# Altium project Telem.PrjPCB
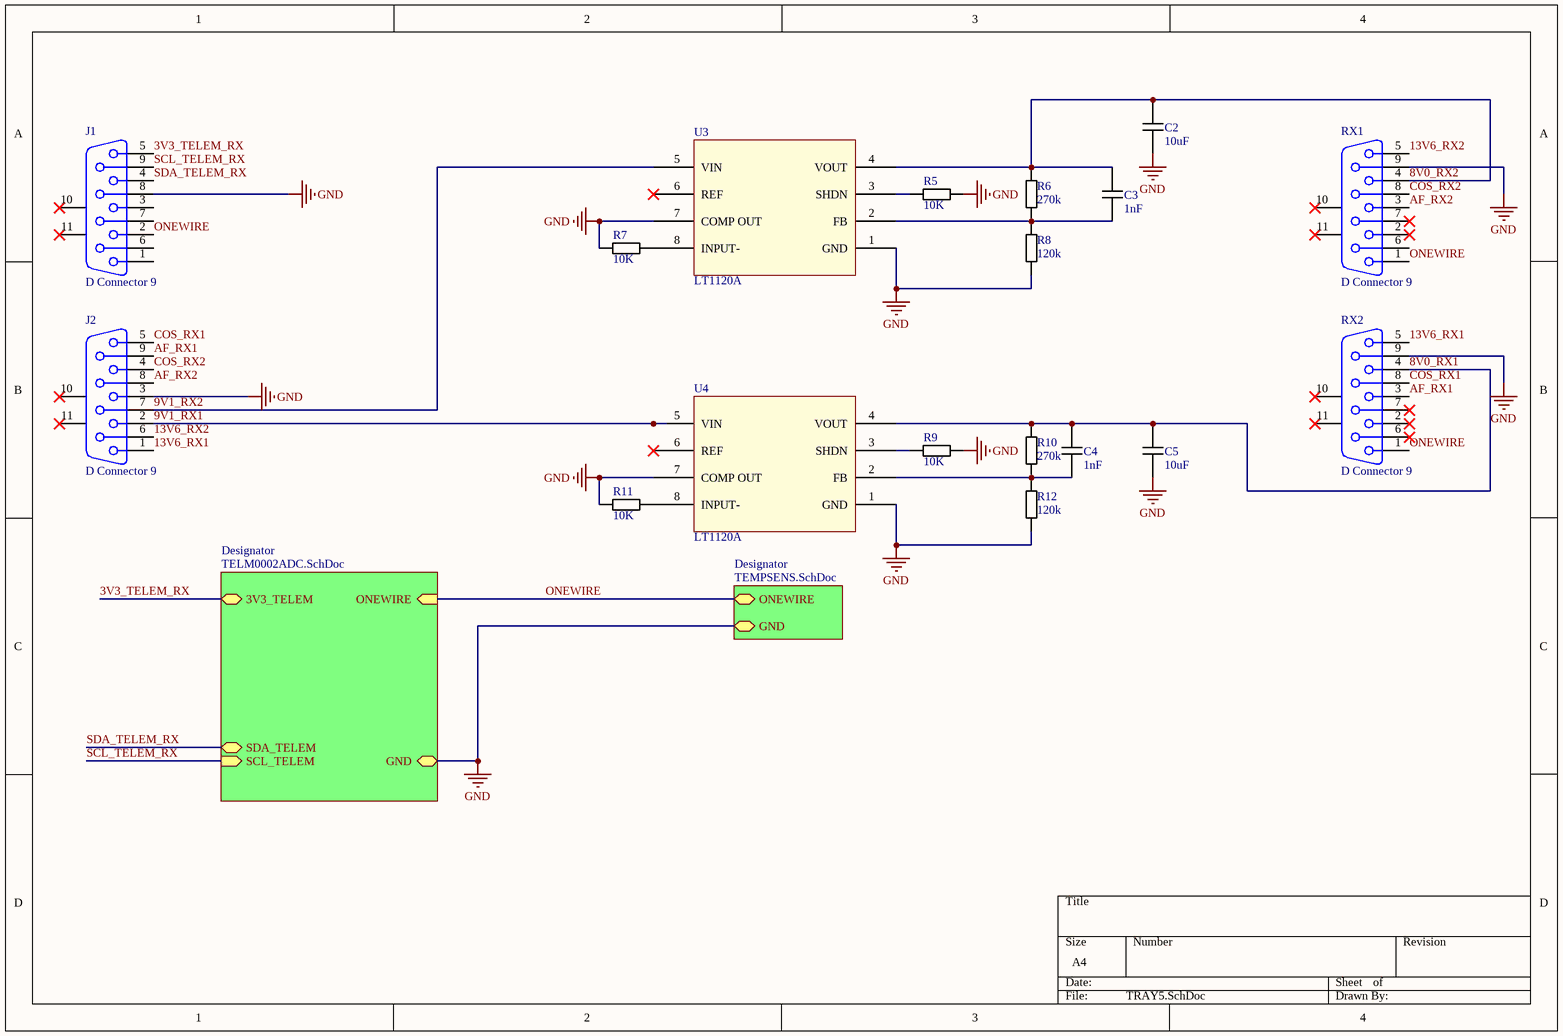
[diagram p0: TRAY5.SchDoc]
3 sheets, 29 parts. Net scope: strictly hierarchical (ports join the sheet entries above them; power ports are local).
Board file: TRAY5.PcbDoc
Sheets:
  TRAY5.SchDoc
    Designator = TELM0002ADC.SchDoc
    Designator = TEMPSENS.SchDoc

## Sheet TRAY5.SchDoc
size A4

### Parts
C2  value 10uF  [0805 Cap]  (hidden comment: 0805 Cap)
C3  value 1nF  [0805 Cap]  (hidden comment: 0805 Cap)
C4  value 1nF  [0805 Cap]  (hidden comment: 0805 Cap)
C5  value 10uF  [0805 Cap]  (hidden comment: 0805 Cap)
J1  D Connector 9  [DSUB1.385-2H9]
J2  D Connector 9  [DSUB1.385-2H9]
R5  value 10K  [0805 Resistor]  (hidden comment: 0805 Resistor)
R6  value 270k  [0805 Resistor]  (hidden comment: 0805 Resistor)
R7  value 10K  [0805 Resistor]  (hidden comment: 0805 Resistor)
R8  value 120k  [0805 Resistor]  (hidden comment: 0805 Resistor)
R9  value 10K  [0805 Resistor]  (hidden comment: 0805 Resistor)
R10  value 270k  [0805 Resistor]  (hidden comment: 0805 Resistor)
R11  value 10K  [0805 Resistor]  (hidden comment: 0805 Resistor)
R12  value 120k  [0805 Resistor]  (hidden comment: 0805 Resistor)
RX1  D Connector 9  [DSUB Upright]
RX2  D Connector 9  [DSUB Upright]
U3  LT1120A  [SOIC8 - LT1120A]
U4  LT1120A  [SOIC8 - LT1120A]

### Sub-sheets
Designator = TELM0002ADC.SchDoc: SDA_TELEM (bidir), SCL_TELEM (in), ONEWIRE (in), 3V3_TELEM, GND
Designator = TEMPSENS.SchDoc: GND, ONEWIRE (bidir)

### Nets
3V3_TELEM_RX: J1.5 ; sheet Designator/3V3_TELEM
GND: C2.1 C5.1 J1.8 J2.3 R5.2 R7.1 R8.1 R9.2 R11.1 R12.1 RX1.9 RX2.9 U3.1(GND) U3.7(COMP_OUT) U4.1(GND) U4.7(COMP_OUT) ; sheet Designator/GND, sheet Designator/GND
8V0_RX1: C4.2 C5.2 R10.2 RX2.4 U4.4(VOUT)
8V0_RX2: C2.2 C3.2 R6.2 RX1.4 U3.4(VOUT)
9V1_RX1: J2.2 U4.5(VIN)
9V1_RX2: J2.7 U3.5(VIN)
13V6_RX1: J2.1 RX2.5
13V6_RX2: J2.6 RX1.5
AF_RX1: J2.9 RX2.3
AF_RX2: J2.8 RX1.3
COS_RX1: J2.5 RX2.8
COS_RX2: J2.4 RX1.8
ONEWIRE: J1.2 RX1.1 RX2.1 ; sheet Designator/ONEWIRE, sheet Designator/ONEWIRE
SCL_TELEM_RX: J1.9 ; sheet Designator/SCL_TELEM
SDA_TELEM_RX: J1.4 ; sheet Designator/SDA_TELEM
NetC3_1: C3.1 R6.1 R8.2 U3.2(FB)
NetC4_1: C4.1 R10.1 R12.2 U4.2(FB)
NetR5_1: R5.1 U3.3(SHDN)
NetR7_2: R7.2 U3.8(INPUT-)
NetR9_1: R9.1 U4.3(SHDN)
NetR11_2: R11.2 U4.8(INPUT-)

Not connected (* = marked no-connect by the designer): J1 1 3 6 7 10(MH1)* 11(MH2)*; J2 10(MH1)* 11(MH2)*; RX1 2* 6 7* 10(MH1)* 11(MH2)*; RX2 2* 6* 7* 10(MH1)* 11(MH2)*; U3 6(REF)*; U4 6(REF)*

### Library data of the parts
C2-C5 = 0805 MLCC - NP0, 5%: Supplier: Digikey
  C2 C5: Supplier P/N: JMK212AB7106KG-T
  C3 C4: Supplier P/N: UMK212B7105KG-T
J1 J2 RX1 RX2 = D Connector 9: Receptacle Assembly, 9 Position, Right Angle; Supplier: Digikey
R5-R12 = 0805 Thick Film Resistor 1%: Supplier: Digikey
  R6 R10: Supplier P/N: RC0805FR-07270KL
  R8 R12: Supplier P/N: RC0805FR-07120KL
U3 U4 = LT1120A: Supplier: Digikey; Supplier P/N: LT1120ACS8#PBF-ND

## Sheet TELM0002ADC.SchDoc: MAX127 Telemetry Circuit
size A3; Engineer: A. SHAW; Organization: BLUEsat Project; Address1: Room 419; Address2: School of EE&T; Address3: UNSW, NSW 2052; Address4: Australia; DocumentNumber: TELM0002; SheetNumber: 1; SheetTotal: 1; Description: Telemetry ADC Circuit; Version: 1.0
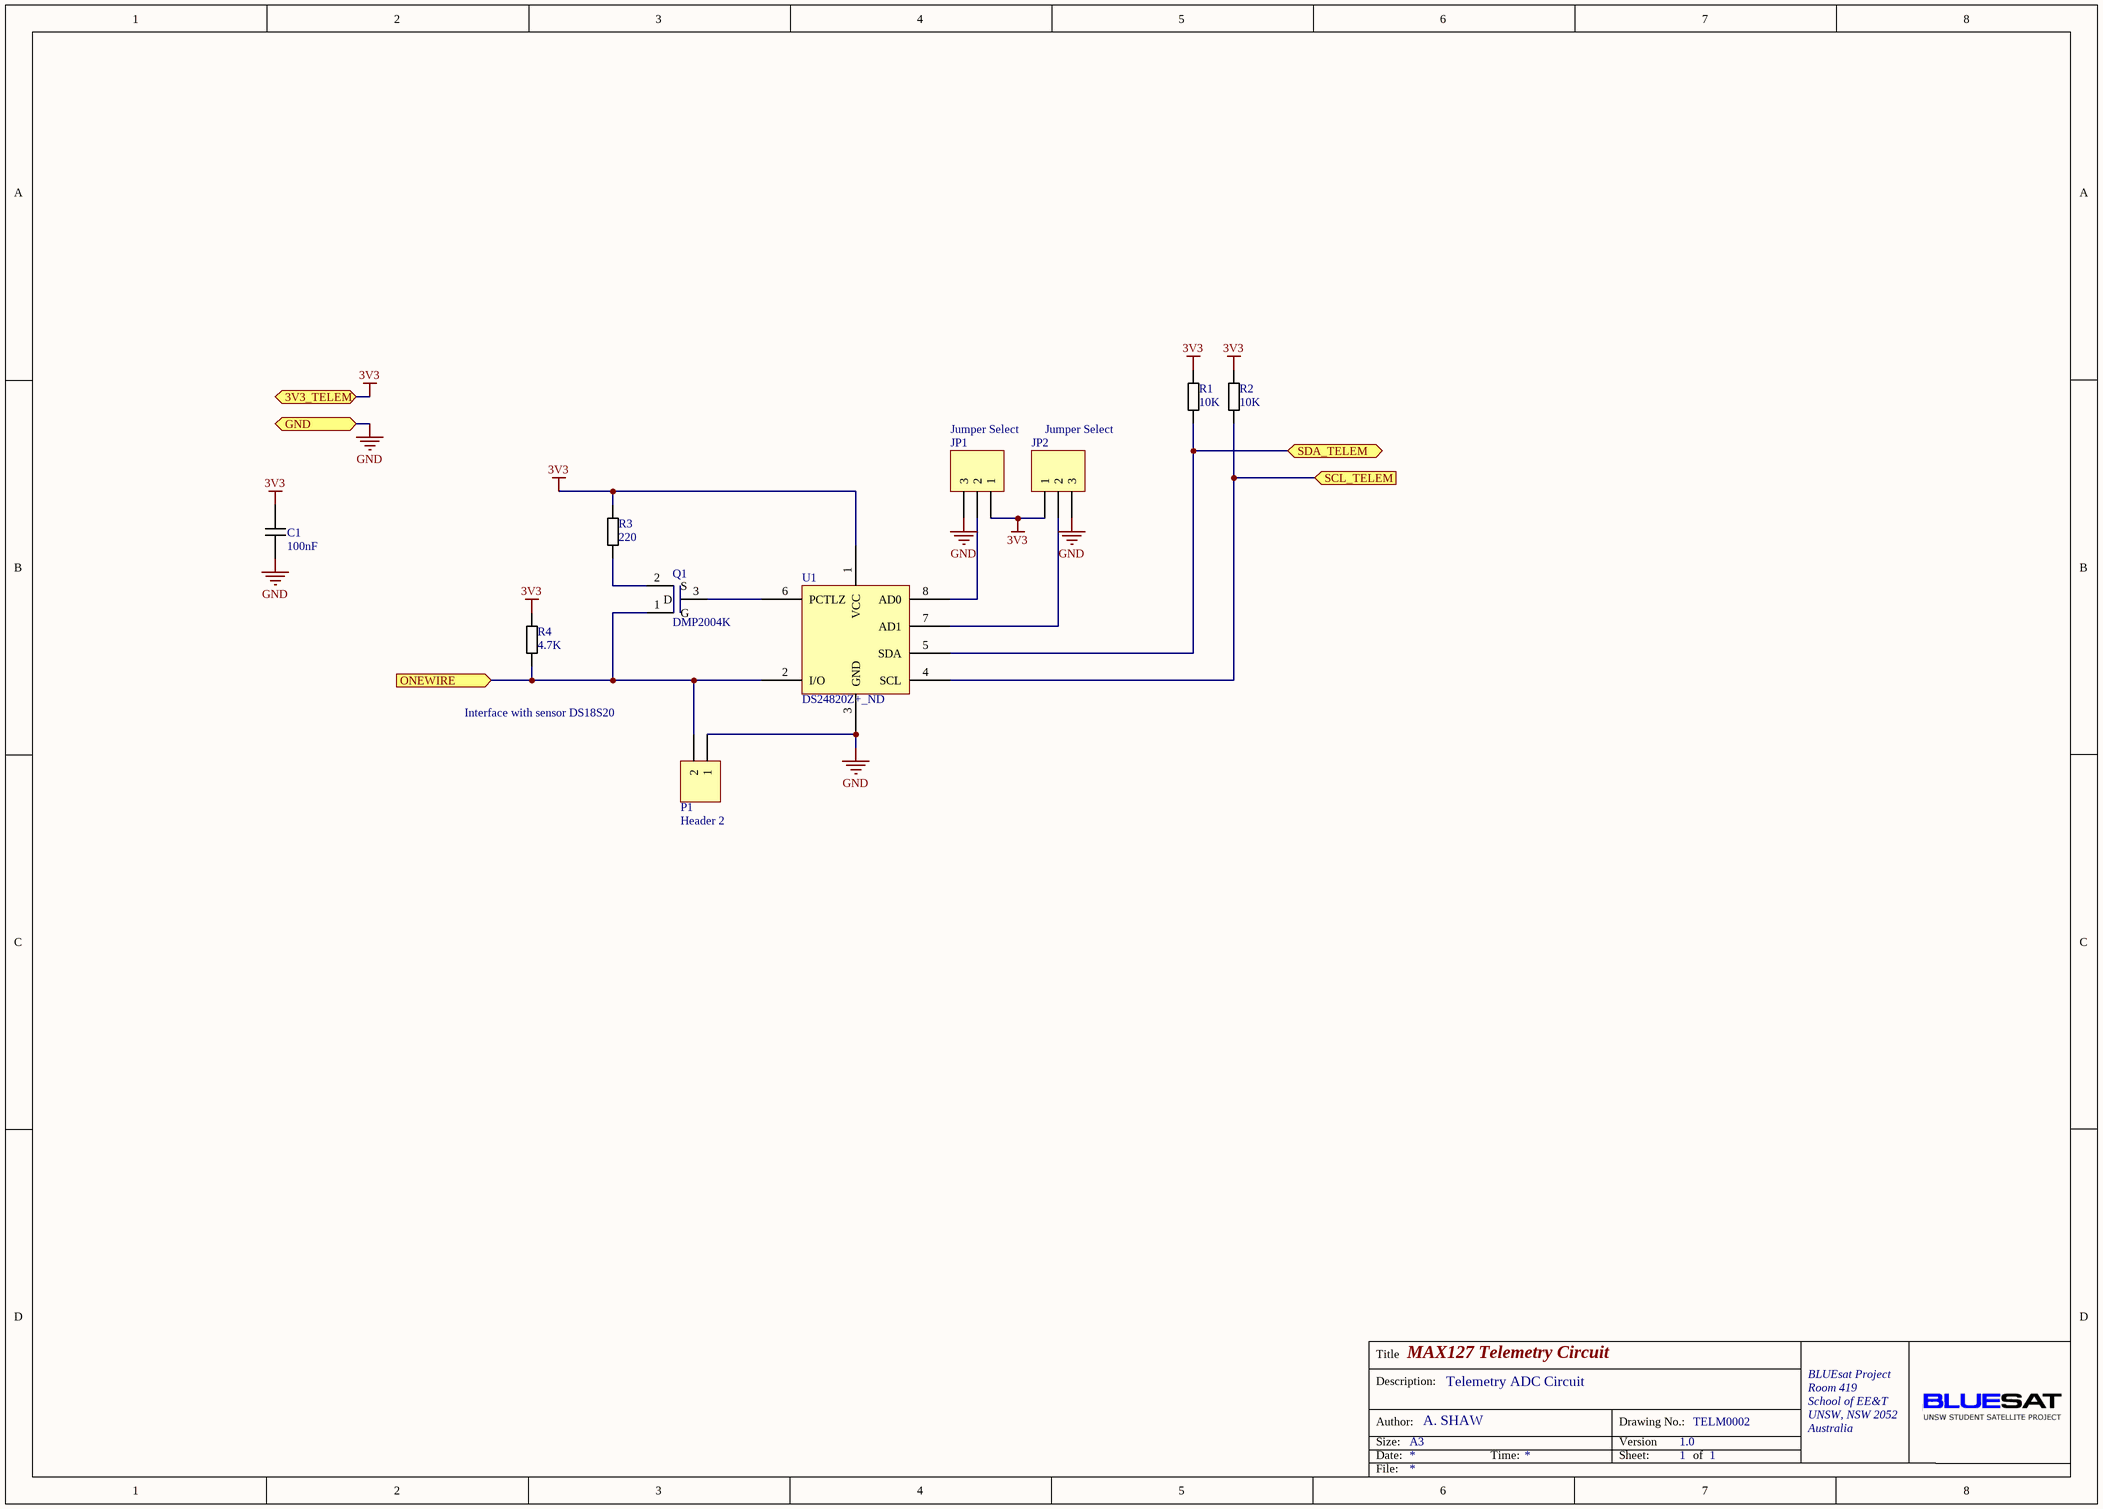
[diagram p1: TELM0002ADC.SchDoc]

### Parts
C1  value 100nF  [0805 Cap]  (hidden comment: 0805 Cap)
JP1  Jumper Select  [SOLDER_JUMPER_3_A]  (no BOM)
JP2  Jumper Select  [SOLDER_JUMPER_3_A]  (no BOM)
P1  Header 2  [HDR1X2]
Q1  DMP2004K  [DMP2004KDITR-ND]
R1  value 10K  [0805 Resistor]  (hidden comment: 0805 Resistor)
R2  value 10K  [0805 Resistor]  (hidden comment: 0805 Resistor)
R3  value 220  [0805 Resistor]  (hidden comment: 0805 Resistor)
R4  value 4.7K  [0805 Resistor]  (hidden comment: 0603 Resistor)
U1  DS24820Z+_ND  [DS2482-100]

### Ports
3V3_TELEM, GND, ONEWIRE (in), SCL_TELEM (in), SDA_TELEM (bidir)

### Nets
3V3: C1.2 JP1.1 JP2.1 R1.2 R2.2 R3.2 R4.2 U1.1(VCC) ; port 3V3_TELEM  [project net 3V3_TELEM_RX]
GND: C1.1 JP1.3 JP2.3 P1.1 U1.3(GND) ; port GND
ONEWIRE: P1.2 Q1.1(G) R4.1 U1.2(I/O) ; port ONEWIRE
SCL_TELEM_RX: R2.1 U1.4(SCL) ; port SCL_TELEM
SDA_TELEM_RX: R1.1 U1.5(SDA) ; port SDA_TELEM
NetJP1_2: JP1.2 U1.8(AD0)
NetJP2_2: JP2.2 U1.7(AD1)
NetQ1_2: Q1.2(S) R3.1
NetQ1_3: Q1.3(D) U1.6(PCTLZ)

### Notes on the sheet
- Interface with sensor DS18S20
- Title
- Description:
- Size:
- Author:
- Date:
- A3
- Time:
- Version
- Sheet:
- Drawing No.:
- of
- File:

### Library data of the parts
C1 = 0805 MLCC - X7R, 10%: Supplier: Digikey
JP1 JP2 = Header 3: Header, 3-Pin; Supplier: Digikey
P1 = Header 2: Header, 2-Pin; Supplier: Digikey
Q1 = DMP2004K: MOSFET P-CH 20V 600MA SOT23-3; Supplier: Digikey
R1-R3 = 0805 Thick Film Resistor 1%: Supplier: Digikey
R4 = 0603 Thick Film Resistor 1%: Supplier: Digikey
U1 = DS24820Z+_ND: Supplier: Digikey

## Sheet TEMPSENS.SchDoc
size A4
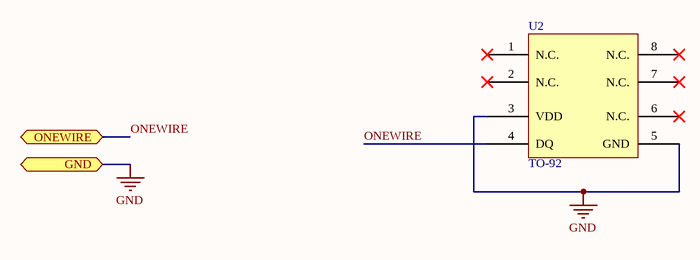
[diagram p2: TEMPSENS.SchDoc]

### Parts
U2  TO-92  [DS18S20]

### Ports
GND, ONEWIRE (bidir)

### Nets
GND: U2.3(VDD) U2.5(GND) ; port GND
ONEWIRE: U2.4(DQ) ; port ONEWIRE

Not connected (* = marked no-connect by the designer): U2 1(N.C.)* 2(N.C.)* 6(N.C.)* 7(N.C.)* 8(N.C.)*

### Library data of the parts
U2 = DS18S20

## Nets that join several sheets
3V3_TELEM_RX: TRAY5 (J1.5), TELM0002ADC (8 pins)
GND: TRAY5 (16 pins), TELM0002ADC (5 pins), TEMPSENS (U2.3 U2.5)
ONEWIRE: TRAY5 (J1.2 RX1.1 RX2.1), TELM0002ADC (P1.2 Q1.1 R4.1 U1.2), TEMPSENS (U2.4)
SCL_TELEM_RX: TRAY5 (J1.9), TELM0002ADC (R2.1 U1.4)
SDA_TELEM_RX: TRAY5 (J1.4), TELM0002ADC (R1.1 U1.5)